# Altium schematic sheet M24512-DFMC6TG.SchDoc
size A4; SheetNumber: 3; SheetTotal: 11
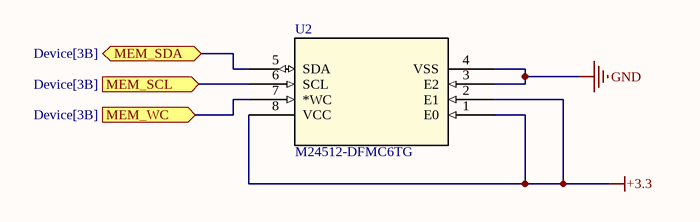
[diagram p0: M24512-DFMC6TG.SchDoc]

## Parts
U2  M24512-DFMC6TG  [UFDFPN8_STM]

## Ports
MEM_SCL (in, see Device[3B]), MEM_SDA (bidir, see Device[3B]), MEM_WC (in, see Device[3B])

## Nets
+3.3: U2.1(E0) U2.2(E1) U2.8(VCC)
GND: U2.3(E2) U2.4(VSS)
MEM_SCL: U2.6(SCL) ; port MEM_SCL
MEM_SDA: U2.5(SDA) ; port MEM_SDA
MEM_WC: U2.7(*WC) ; port MEM_WC

## Library data of the parts
U2 = M24512-DFMC6TG: Mfr_Name: STMicroelectronics; Copyright: Copyright (C) 2023 Ultra Librarian. All rights reserved.; Manufacturer_Part_Number: M24512-DFMC6TG; RefDes: RefDes; Type: DEV